# EAGLE design Sildr 1.2 (EAGLE 9.4.0)
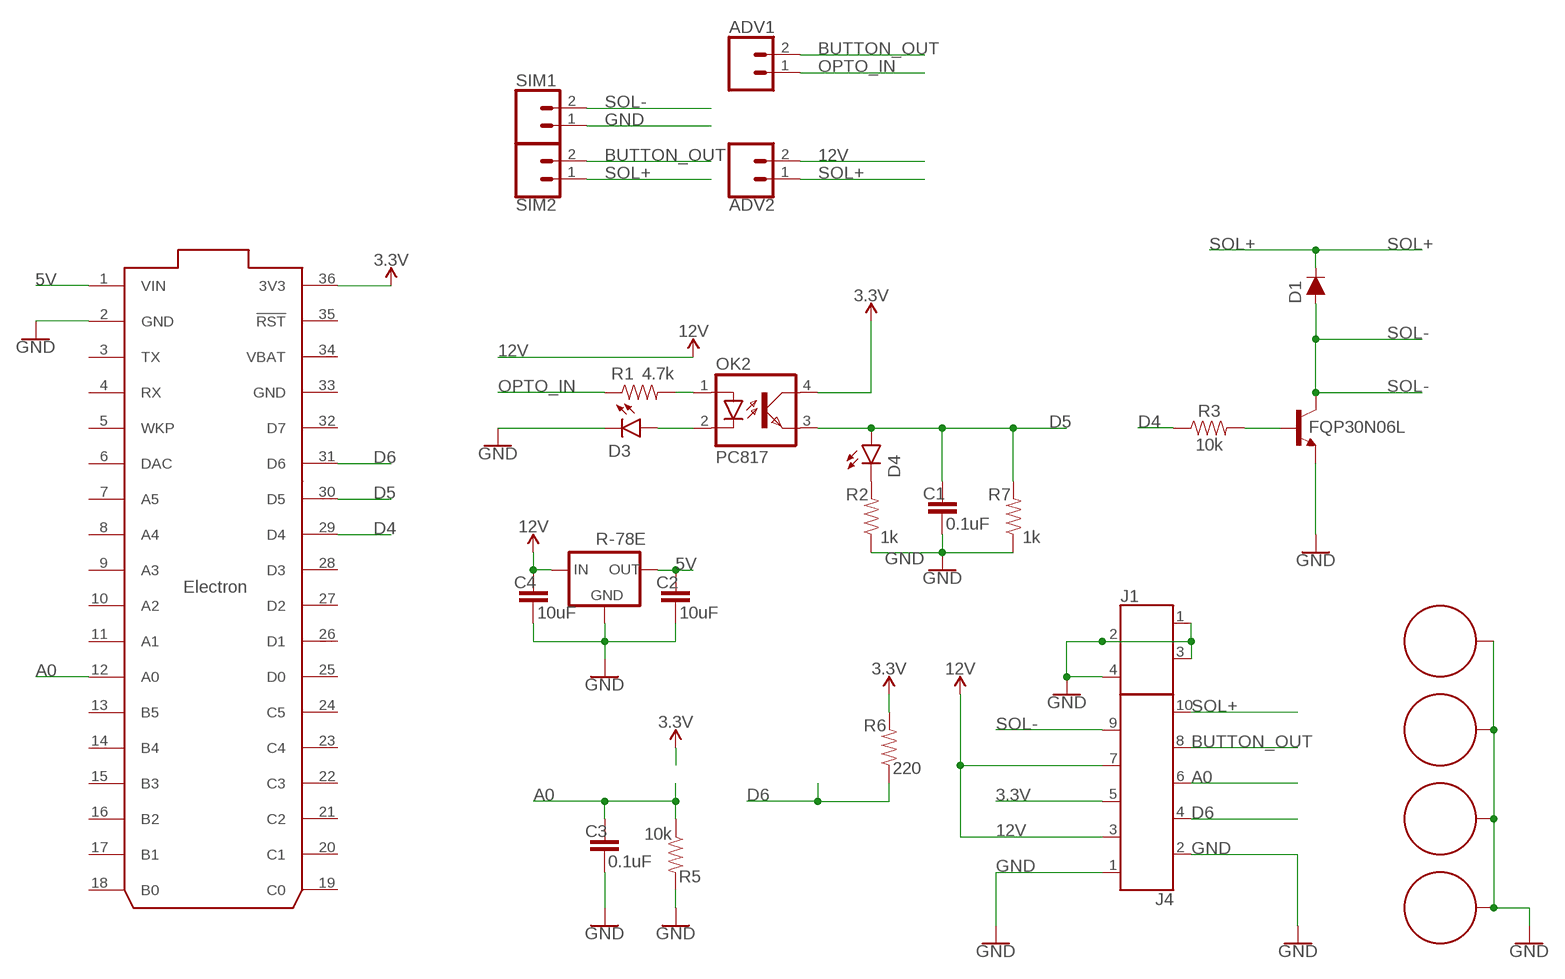
[diagram p0: schematic, sheet 1]

## Parts
ADV1  CONN_02  [1X02]
ADV2  CONN_02  [1X02]
C1  0.1uF  0.1UF-KIT-EZ-50V-20%  [CAP-PTH-SMALL-KIT]
C2  10uF  0.1UF-KIT-EZ-50V-20%  [CAP-PTH-SMALL-KIT]
C3  0.1uF  0.1UF-KIT-EZ-50V-20%  [CAP-PTH-SMALL-KIT]
C4  10uF  0.1UF-KIT-EZ-50V-20%  [CAP-PTH-SMALL-KIT]
D1  1A/50V/1.1V  DIODE-PTH  [DIODE-1N4001]
D3  LED3MM  [LED_3MM]
D4  LED3MM  [LED_3MM]
FQP30N06L  2SC1944  [T-30_V]
H1  STANDOFF_ELECTRICAL  [STANDOFF-ELECTRICAL]
H2  STANDOFF_ELECTRICAL  [STANDOFF-ELECTRICAL]
H3  STANDOFF_ELECTRICAL  [STANDOFF-ELECTRICAL]
H6  STANDOFF_ELECTRICAL  [STANDOFF-ELECTRICAL]
J1  691412320004  [691412320004]
J4  691412320010  [691412320010]
OK2  PC817  [DIL04]
R1  4.7k  10KOHM-HORIZ-1/4W-5%  [AXIAL-0.3]
R2  1k  10KOHM-HORIZ-1/4W-5%  [AXIAL-0.3]
R3  10k  10KOHM-HORIZ-1/4W-5%  [AXIAL-0.3]
R5  10k  10KOHM-HORIZ-1/4W-5%  [AXIAL-0.3]
R6  220  10KOHM-HORIZ-1/4W-5%  [AXIAL-0.3]
R7  1k  10KOHM-HORIZ-1/4W-5%  [AXIAL-0.3]
R-78E  R-78E5.0-1.0  [DC-DC_CONVERTER_78XX]
SIM1  CONN_02  [1X02]
SIM2  CONN_02  [1X02]
U$1  ELECTRON_WITH_HEADERS  [ELECTRON]

## Nets
3.3V: J4.5 OK2.4(COL) R6.P$2 U$1.36(3V3)
5V: C2.1 R-78E.VOUT(OUT) U$1.1(VIN)
12V: ADV2.2 C4.1 J4.3 J4.7 R-78E.VIN(IN)
A0: C3.1 J4.6 R5.P$1 U$1.12(A0)
BUTTON_OUT: ADV1.2 J4.8 SIM2.2
D4: R3.P$1 U$1.29(D4)
D5: C1.1 D4.A OK2.3(EMIT) R7.P$2 U$1.30(D5)
D6: J4.4 R6.P$1 U$1.31(D6)
GND: C1.2 C2.2 C3.2 C4.2 D3.K(C) FQP30N06L.3(E) H1.P1 H2.P1 H3.P1 H6.P1 J1.1 J1.2 J1.3 J1.4 J4.1 J4.2 R2.P$1 R5.P$2 R7.P$1 R-78E.GND SIM1.1 U$1.2(GND)
N$1: FQP30N06L.1(B) R3.P$2
N$2: D3.A OK2.2(C)
N$3: OK2.1(A) R1.P$2
N$4: D4.K(C) R2.P$2
OPTO_IN: ADV1.1 R1.P$1
SOL+: ADV2.1 D1.C J4.10 SIM2.1
SOL-: D1.A FQP30N06L.2(C) J4.9 SIM1.2
Unconnected: U$1.3(TX) U$1.4(RX) U$1.5(WKP) U$1.6(DAC) U$1.7(A5) U$1.8(A4) U$1.9(A3) U$1.10(A2) U$1.11(A1) U$1.13(B5) U$1.14(B4) U$1.15(B3) U$1.16(B2) U$1.17(B1) U$1.18(B0) U$1.19(C0) U$1.20(C1) U$1.21(C2) U$1.22(C3) U$1.23(C4) U$1.24(C5) U$1.25(D0) U$1.26(D1) U$1.27(D2) U$1.28(D3) U$1.32(D7) U$1.35(!RST)

## Power pins joined to a net without a drawn wire
GND: U$1.33(GND)
VBAT: U$1.34(VBAT)

## Library data of the parts
ADV1 ADV2 SIM1 SIM2 = SparkFun-Connectors:CONN_02: Multi connection point. Often used as Generic Header-pin footprint for 0.1 inch spaced/style header connections On any of the 0.1 inch spaced packages, you can populate with these: Break Away Headers - Straight <https://www.sparkfun.com/products/116> (PRT-00116) Break Away Male Headers - Right Angle <https://www.sparkfun.com/products/553> (PRT-00553) Female Headers <https://www.sparkfun.com/products/115> (PRT-00115) Break Away Headers - Machine Pin <https://www.sparkfun.com/products/117> (PRT-00117) Break Away Female Headers - Swiss Machine Pin <https://www.sparkfun.com/products/743> (PRT-00743) For SCREWTERMINALS and SPRING TERMINALS visit here: Screw Terimnals on SparkFun.com <https://www.sparkfun.com/search/results?term=Screw+Terminals> (5mm/3.5mm/2.54mm spacing) This device is also useful as a general connection point to wire up your design to another part of your project. Our various solder wires solder well into these plated through hole pads. Hook-Up Wire - Assortment (Stranded, 22 AWG) <https://www.sparkfun.com/products/11375> (PRT-11375) Hook-Up Wire - Assortment (Solid Core, 22 AWG) <https://www.sparkfun.com/products/11367> (PRT-11367) View the entire wire category on our website here <https://www.sparkfun.com/categories/141> Special notes: Molex polarized connector foot print use with: PRT-08233 with associated crimp pins and housings. 2.54_SCREWTERM for use with PRT-10571. 3.5mm Screw Terminal footprints for PRT-08084 5mm Screw Terminal footprints for use with PRT-08432
C1 C3 = SparkFun-Capacitors:0.1UF: 0.1µF ceramic capacitors A capacitor is a passive two-terminal electrical component used to store electrical energy temporarily in an electric field.; PROD_ID: CAP-08370
C2 C4 = SparkFun-Capacitors:0.1UF: 0.1µF ceramic capacitors A capacitor is a passive two-terminal electrical component used to store electrical energy temporarily in an electric field.; PROD_ID: CAP-08370; VALUE: 0.1uF
D1 = SparkFun-DiscreteSemi:DIODE: Diode These are standard reverse protection diodes and small signal diodes. SparkFun Products: SparkFun SparkPunk Sound Kit <https://www.sparkfun.com/products/11177> SparkFun ESP8266 Thing <https://www.sparkfun.com/products/13231>; PROD_ID: DIO-09176
D3 D4 = SparkFun-LED:LED: LED (Generic) Standard schematic elements and footprints for 5mm, 3mm, 1206, and 0603 sized LEDs. Generic LEDs with no color specified.; PROD_ID: DIO-08794
FQP30N06L = transistor:2SC1944: NPN Epitaxial Planar Transistor RF Power Amplifier Source: 2SC1944.pdf
H1-H3 H6 = SparkFun-Hardware:STANDOFF_ELECTRICAL: Stand Off Drill holes with an electrical connection. For example, use these to ground your board to a chassis. Example SparkFun Products Screw - Phillips Head (1/4", 4-40, 10 pack) <https://www.sparkfun.com/products/10453> (PRT-10453) Screw - Phillips Head (1/2", 4-40, 10 pack) <https://www.sparkfun.com/products/10452> (PRT-10452) Screw - Phillips Head (3/4", 4-40, 10 pack) <https://www.sparkfun.com/products/10451> (PRT-10451) Screw - Phillips Head (1", 4-40, 10 pack) <https://www.sparkfun.com/products/10450> (PRT-10450)
J1 = TerminalBlocks (rev19a):691412320004: SERIE 4123 - 3.81 MM - 45° CABLE ENTRY SCREWLESS - WR-TBL <http://katalog.we-online.de/media/images/v2/Family_WR-TBL4_6914123200xx.jpg> Details see: http://katalog.we-online.de/en/em/TBL_3_81_4123_SCREWLESS_45%C2%B0_ENTRY_6914123200xx Created by Yingchun,Shan 2016(C) Wurth Elektronik
J4 = TerminalBlocks (rev19a):691412320010: SERIE 4123 - 3.81 MM - 45° CABLE ENTRY SCREWLESS - WR-TBL <http://katalog.we-online.de/media/images/v2/Family_WR-TBL4_6914123200xx.jpg> Details see: http://katalog.we-online.de/en/em/TBL_3_81_4123_SCREWLESS_45%C2%B0_ENTRY_6914123200xx Created by Yingchun,Shan 2016(C) Wurth Elektronik
OK2 = optocoupler:PC817: SHARP OPTO COUPLER; MPN: PC817X4J000F; OC_FARNELL: 9707727; OC_NEWARK: 97K7059
R1 R2 R6 R7 = SparkFun-Resistors:10KOHM: 10kΩ resistor A resistor is a passive two-terminal electrical component that implements electrical resistance as a circuit element. Resistors act to reduce current flow, and, at the same time, act to lower voltage levels within circuits. - Wikipedia; PROD_ID: RES-09435; VALUE: 10k
R3 R5 = SparkFun-Resistors:10KOHM: 10kΩ resistor A resistor is a passive two-terminal electrical component that implements electrical resistance as a circuit element. Resistors act to reduce current flow, and, at the same time, act to lower voltage levels within circuits. - Wikipedia; PROD_ID: RES-09435
R-78E = SparkFun-IC-Power:R-78E5.0-1.0: Recom Power 5V 1A DC/DC Converter The Recom R-78E5.0-X.X is a compact DC/DC converter module that is a pin for pin drop-in replacement for the LM7805 linear voltage regulator. Specifications: Input Range: 7-28V Output Voltage: 5V Output Current: 1A Max Efficiency: 91% Datasheet <https://www.recom-power.com/pdf/Innoline/R-78Exx-1.0.pdf>; PROD_ID: COM-13655
U$1 = Particle-Devices:ELECTRON: The Particle Electron is a tiny development kit for creating cellular-connected electronics projects and products. It comes with a SIM card (Nano 4FF) and an affordable data plan for low-bandwidth things. Design files : here <https://github.com/particle-iot/electron> Product Page : Datasheet <https://docs.particle.io/datasheets/electron-(cellular)/electron-datasheet/> Github : Particle devices library <https://github.com/particle-iot/hardware-libraries/tree/master/Eagle>

## Board
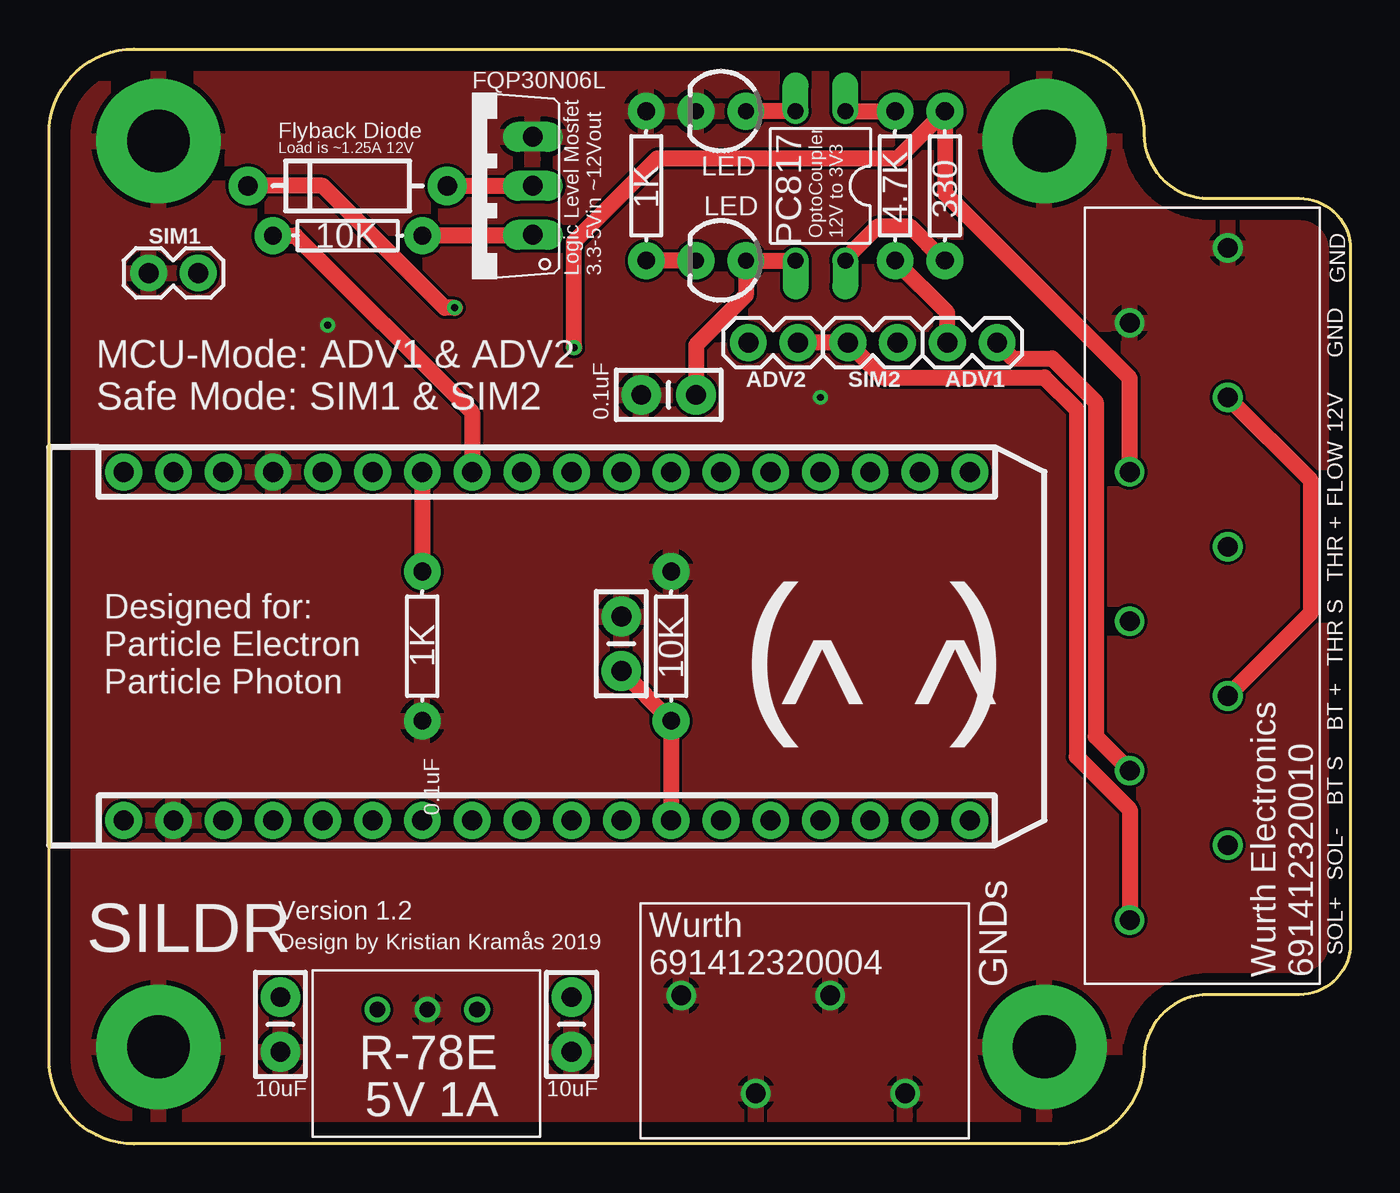
[diagram p1: board, top side]
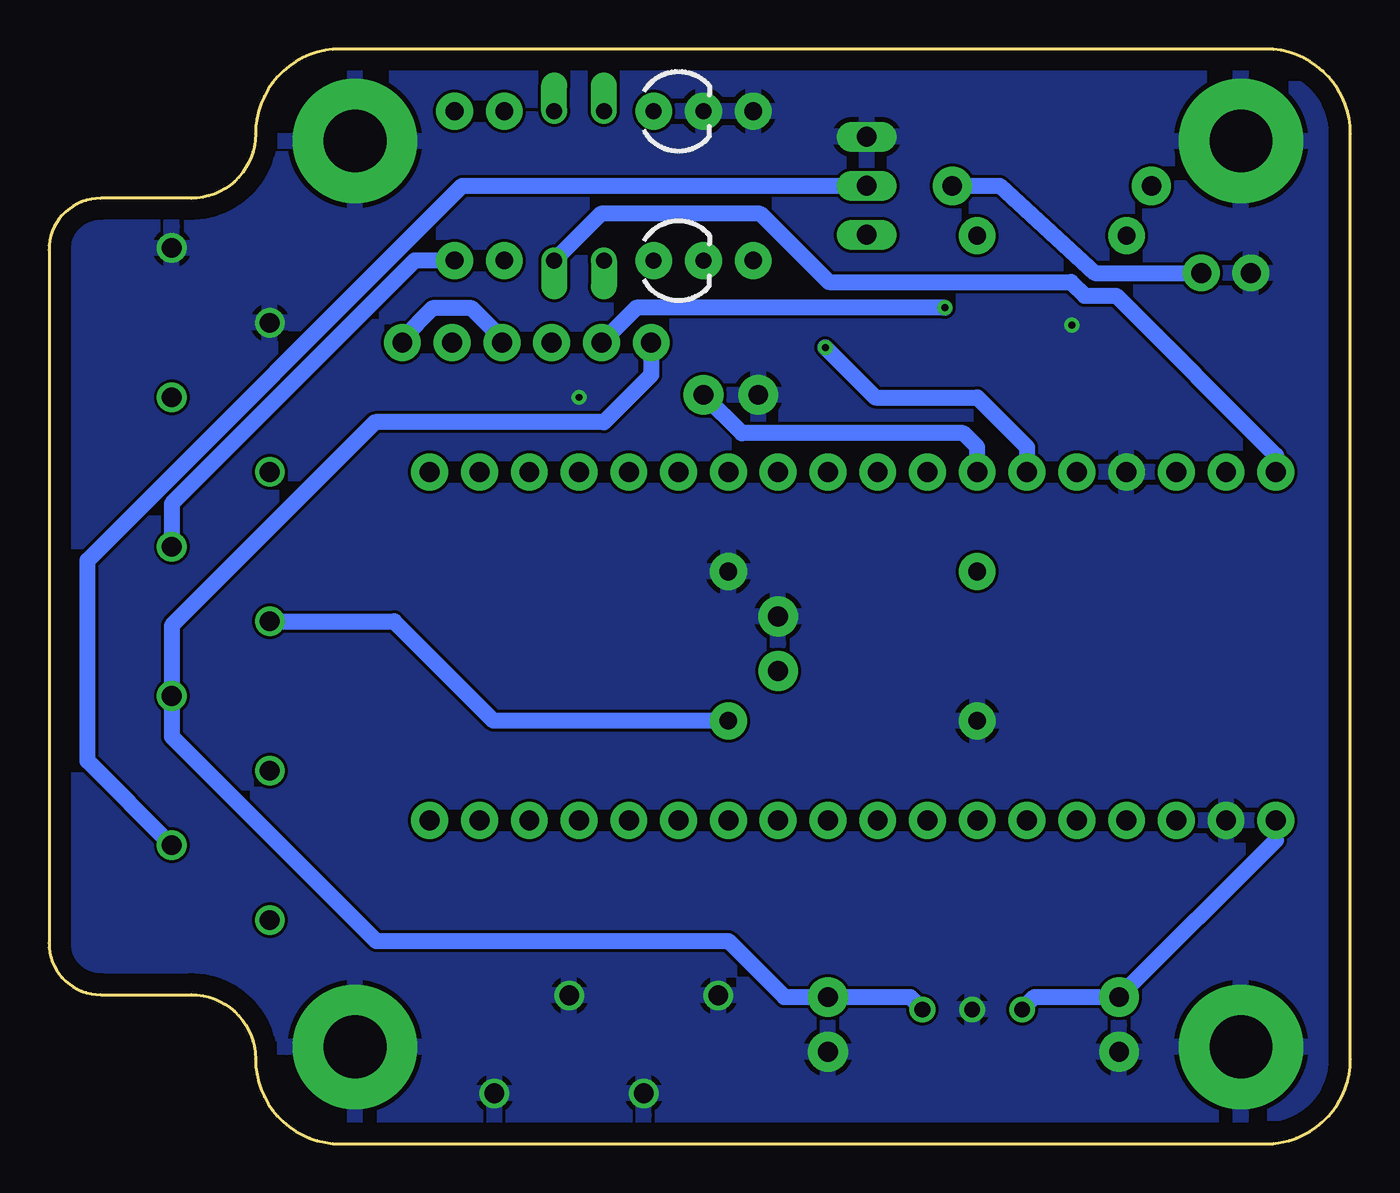
[diagram p2: board, bottom side, seen from below]

Size 66.42 x 55.88 mm. Coordinates in mm from the lower left corner, seen from the top.
Outline: 63.79,7.62 59.16,7.62 arc90 55.88,4.34 arc-90 51.54,0 4.34,0 arc-90 0,4.34 0,51.54 arc-90 4.34,55.88 51.54,55.88 arc-90 55.88,51.54 arc90 59.16,48.26 63.79,48.26 arc-90 66.42,45.62 66.42,10.26 arc-90 63.79,7.62
Copper layers (1*16): Top 0.035mm / dielectric 1.5mm / Bottom 0.035mm
Design rules "default": minimum track width 6mil, minimum drill 0.35mm, track to track 6mil, track to pad 6mil, pad to pad 6mil, via to via 6mil, smd to smd 6mil, copper to edge 40mil, drill to drill 6mil, minimum pad ring 10mil, minimum via ring 8mil, stop-mask expansion 4mil, vias tented up to drill 0mil, thermal gap 10mil

### Footprints (pad centres in the part's own frame; a part is rotated, then mirrored left to right if it is on the bottom)
1X02 = drill 1.016 pad 1.88: 1 0,0; 2 2.54,0
CAP-PTH-SMALL-KIT = drill 1.016 pad 2.032: 1 -1.397,0; 2 1.397,0
DIODE-1N4001 = drill 1 pad 1.981: A -5.08,0; C 5.08,0
LED_3MM = drill 0.813 pad 1.88: A -1.27,0; K 1.27,0
T-30_V = drill 1.016 long: 1 -2.5,-3.1; 2 0,-3.1; 3 2.5,-3.1
STANDOFF-ELECTRICAL = drill 3.2 pad 6.35: P1 0,0
691412320004 = drill 1: 1 5.715,-2.5; 2 1.905,2.5; 3 -1.905,-2.5; 4 -5.715,2.5
691412320010 = drill 1: 1 17.145,-2.5; 2 13.335,2.5; 3 9.525,-2.5; 4 5.715,2.5; 5 1.905,-2.5; 6 -1.905,2.5; 7 -5.715,-2.5; 8 -9.525,2.5; 9 -13.335,-2.5; 10 -17.145,2.5
DIL04 = drill 0.813 offset: 1 -1.27,-3.81; 2 1.27,-3.81; 3 1.27,3.81; 4 -1.27,3.81
AXIAL-0.3 = drill 0.9 pad 1.88: P$1 -3.81,0; P$2 3.81,0
DC-DC_CONVERTER_78XX = drill 0.8: GND 0,0; VIN -2.54,0; VOUT 2.54,0
ELECTRON = drill 1.016 pad 1.88: 1 1.27,46.99; 2 1.27,44.45; 3 1.27,41.91; 4 1.27,39.37; 5 1.27,36.83; 6 1.27,34.29; 7 1.27,31.75; 8 1.27,29.21; 9 1.27,26.67; 10 1.27,24.13; 11 1.27,21.59; 12 1.27,19.05; 13 1.27,16.51; 14 1.27,13.97; 15 1.27,11.43; 16 1.27,8.89; 17 1.27,6.35; 18 1.27,3.81; 19 19.05,3.81; 20 19.05,6.35; 21 19.05,8.89; 22 19.05,11.43; 23 19.05,13.97; 24 19.05,16.51; 25 19.05,19.05; 26 19.05,21.59; 27 19.05,24.13; 28 19.05,26.67; 29 19.05,29.21; 30 19.05,31.75; 31 19.05,34.29; 32 19.05,36.83; 33 19.05,39.37; 34 19.05,41.91; 35 19.05,44.45; 36 19.05,46.99

### Placement (x,y rotation side)
ADV1  45.85,40.89 0 top
ADV2  38.23,40.89 180 top
C1  31.62,38.23 180 top
C2  11.81,6.1 270 top
C3  29.21,25.53 90 top
C4  26.67,6.1 270 top
D1  15.24,48.9 180 top
D3  34.29,52.7 180 top
D4  34.29,45.09 180 top
FQP30N06L  21.59,48.9 90 top
H1  5.59,4.95 0 top
H2  5.59,51.18 0 top
H3  50.8,51.18 0 top
H6  50.8,4.95 0 top
J1  37.97,5.08 180 top
J4  57.66,28.57 90 top
OK2  39.37,48.9 180 top
R1  43.18,48.9 90 top
R2  30.48,48.9 270 top
R3  15.24,46.35 0 top
R5  31.75,25.4 90 top
R6  45.72,48.9 270 top
R7  19.05,25.4 90 top
R-78E  19.3,6.86 180 top
SIM1  5.08,44.45 0 top
SIM2  40.77,40.89 0 top
U$1  50.8,15.24 90 top

### Tracks (layer width: path | path; a pad name or v marks a point on that pad's centre or on a via)
3.3V
  Top 0.813: OK2.4 40.64,45.17 42.3,46.84 43.93,46.84 45.68,45.09 R6.P$2
  Bottom 0.813: OK2.4 38.25,47.47 30.11,47.47 26.63,43.99 14.27,43.99 13.56,43.28 11.95,43.28 3.81,35.14 U$1.36 | R6.P$2 47.75,45.09 60.16,32.68 J4.5
5V
  Bottom 0.813: R-78E.VOUT 16.13,7.49 C2.1 3.81,15.49 U$1.1
12V
  Top 0.813: J4.7 64.39,27.09 64.39,33.87 J4.3
  Bottom 0.813: ADV2.2 35.69,39.24 38.1,36.83 49.78,36.83 60.16,26.45 J4.7 60.16,20.79 49.72,10.35 31.75,10.35 28.89,7.49 C4.1 22.48,7.49 R-78E.VIN
A0
  Top 0.813: C3.1 R5.P$1 U$1.12
  Bottom 0.813: J4.6 48.81,26.67 43.73,21.59 R5.P$1
BUTTON_OUT
  Top 0.813: ADV1.2 49.2,40.08 51.2,40.08 53.42,37.87 53.42,20.79 J4.8
  Bottom 0.813: SIM2.2 43.31,41.11 44.84,42.65 46.85,42.65 48.39,41.11 ADV1.2
D4
  Top 0.813: R3.P$1 12.57,46.35 21.59,37.34 U$1.29
D5
  Top 0.813: OK2.3 D4.A 35.56,43.31 33.02,40.77 C1.1 | U$1.30 R7.P$2
  Bottom 0.813: U$1.30 19.05,35.56 19.76,36.27 31.06,36.27 C1.1
D6  (via drill 0.35)
  Top 0.813: J4.4 55.16,39.08 45.72,48.51 R6.P$1 43.31,50.29 31.03,50.29 26.77,46.03 26.77,40.66 v26.8,40.64
  Bottom 0.813: v26.8,40.64 24.26,38.1 19.05,38.1 16.51,35.56 U$1.31
GND  (via drill 0.35)
  other vias: 14.22,41.78 39.37,38.1
  pour Top: 0,57.15 0,0 67.31,0 67.31,57.15
  pour Bottom: 0,57.15 0,0 67.31,0 67.31,57.15
N$1
  Top 0.813: FQP30N06L.1 24.65,46.35 R3.P$2
N$2
  Top 0.813: OK2.2 D3.A
N$3
  Top 0.813: OK2.1 R1.P$2
N$4
  Top 0.813: D4.K R2.P$2
OPTO_IN
  Top 0.813: ADV1.1 45.85,42.42 R1.P$1
SOL+  (via drill 0.35)
  Top 0.813: ADV2.1 SIM2.1 42.55,39.12 50.8,39.12 52.45,37.47 52.45,19.77 55.16,17.07 J4.10 | v20.7,42.67 20.19,42.67 13.97,48.9 D1.C
  Bottom 0.813: ADV2.1 36.45,42.67 v20.7,42.67
SOL-
  Top 0.813: D1.A FQP30N06L.2
  Bottom 0.813: D1.A 17.89,48.9 13.05,44.45 SIM1.2 | FQP30N06L.2 45.34,48.9 64.45,29.78 64.45,19.54 J4.9

### Text on the board
tPlace: PC817 | Flyback Diode | Load is ~1.25A 12V | LED | 1K | LED | 4.7K | 330 | 10K | OptoCoupler / 12V to 3V3 | Logic Level Mosfet / 3.3-5Vin ~12Vout | GND | GND | MCU-Mode: ADV1 & ADV2 / Safe Mode: SIM1 & SIM2 | 0.1uF | 12V | FLOW | THR + | 1K | 10K | ‿ | THR S | Designed for: / Particle Electron / Particle Photon | ( ) | BT + | ^ ^ | 0.1uF | BT S | SOL- | Version 1.2 | SILDR | Design by Kristian Kramås 2019 | SOL+ | Wurth / 691412320004 | Wurth Electronics / 691412320010 | GNDs | 10uF | 10uF | 5V 1A